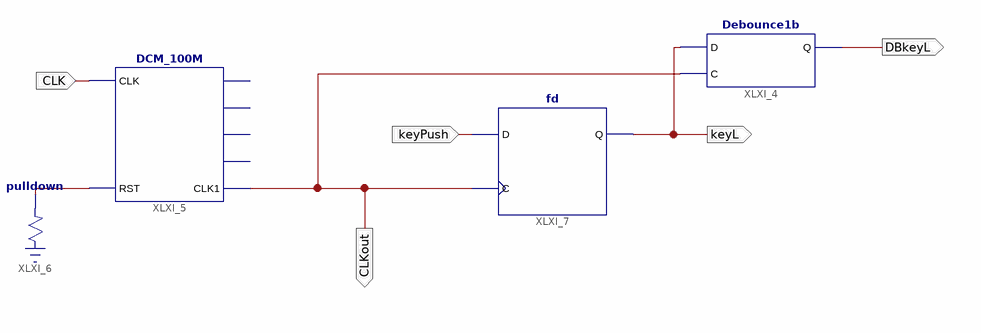
[diagram p0: schematic sheet 1]
// Xilinx ISE schematic DebounceTest.sch (spartan3e) as structural Verilog: 4 symbols, 5 ports
module DebounceTest (
  input  CLK,
  input  keyPush,
  output CLKout,
  output DBkeyL,
  output keyL
);

  wire XLXN_7;

  Debounce1b XLXI_4 (.D(keyL), .C(CLKout), .Q(DBkeyL));
  DCM_100M XLXI_5 (.CLK(CLK), .RST(XLXN_7), .CLK1(CLKout));  // open: CLK1M, CLK10k, CLK1k, CLK100
  \pulldown  XLXI_6 (.O(XLXN_7));
  fd XLXI_7 (.C(CLKout), .D(keyPush), .Q(keyL));
endmodule
